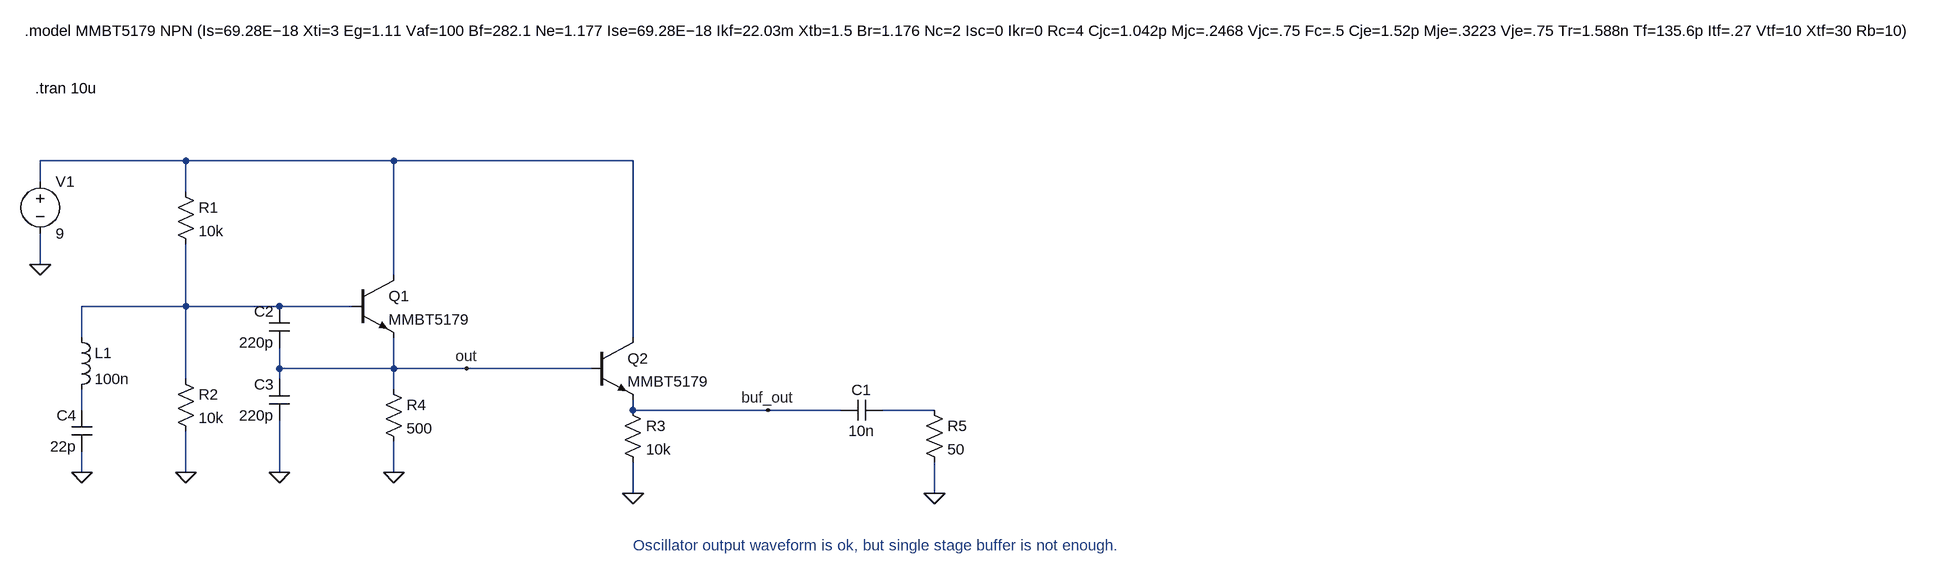
[diagram p0: schematic CC_Clapp_Lund.asc]
CC_Clapp_Lund.asc, the LTspice schematic file:
Version 4
SHEET 1 2820 680
WIRE -192 -240 -416 -240
WIRE 128 -240 -192 -240
WIRE 496 -240 128 -240
WIRE -416 -208 -416 -240
WIRE -192 -192 -192 -240
WIRE -416 -80 -416 -128
WIRE 128 -64 128 -240
WIRE -192 -16 -192 -112
WIRE -192 -16 -352 -16
WIRE -48 -16 -192 -16
WIRE 64 -16 -48 -16
WIRE -352 32 -352 -16
WIRE 496 32 496 -240
WIRE -48 80 -48 48
WIRE 128 80 128 32
WIRE 128 80 -48 80
WIRE 240 80 128 80
WIRE 432 80 240 80
WIRE -192 96 -192 -16
WIRE -48 96 -48 80
WIRE 128 112 128 80
WIRE -352 144 -352 112
WIRE 496 144 496 128
WIRE 704 144 496 144
WIRE 816 144 704 144
WIRE 960 144 880 144
WIRE -352 240 -352 208
WIRE -192 240 -192 176
WIRE -48 240 -48 160
WIRE 128 240 128 192
WIRE 496 272 496 224
WIRE 960 272 960 224
FLAG -416 -80 0
FLAG -352 240 0
FLAG -192 240 0
FLAG -48 240 0
FLAG 128 240 0
FLAG 240 80 out
FLAG 496 272 0
FLAG 704 144 buf_out
FLAG 960 272 0
DATAFLAG -288 -16 ""
DATAFLAG 48 80 ""
DATAFLAG -80 -240 ""
SYMBOL voltage -416 -224 R0
SYMATTR InstName V1
SYMATTR Value 9
SYMBOL res -208 -208 R0
SYMATTR InstName R1
SYMATTR Value 10k
SYMBOL res -208 80 R0
SYMATTR InstName R2
SYMATTR Value 10k
SYMBOL res 112 96 R0
SYMATTR InstName R4
SYMATTR Value 500
SYMBOL cap -32 48 R180
WINDOW 0 24 56 Left 2
WINDOW 3 24 8 Left 2
SYMATTR InstName C2
SYMATTR Value 220p
SYMBOL cap -32 160 R180
WINDOW 0 24 56 Left 2
WINDOW 3 24 8 Left 2
SYMATTR InstName C3
SYMATTR Value 220p
SYMBOL cap -336 208 R180
WINDOW 0 24 56 Left 2
WINDOW 3 24 8 Left 2
SYMATTR InstName C4
SYMATTR Value 22p
SYMBOL ind -368 16 R0
SYMATTR InstName L1
SYMATTR Value 100n
SYMBOL npn 64 -64 R0
SYMATTR InstName Q1
SYMATTR Value MMBT5179
SYMBOL npn 432 32 R0
SYMATTR InstName Q2
SYMATTR Value MMBT5179
SYMBOL res 480 128 R0
SYMATTR InstName R3
SYMATTR Value 10k
SYMBOL cap 880 128 R90
WINDOW 0 0 32 VBottom 2
WINDOW 3 32 32 VTop 2
SYMATTR InstName C1
SYMATTR Value 10n
SYMBOL res 944 128 R0
SYMATTR InstName R5
SYMATTR Value 50
TEXT -440 -440 Left 2 !.model MMBT5179 NPN (Is=69.28E−18 Xti=3 Eg=1.11 Vaf=100 Bf=282.1 Ne=1.177 Ise=69.28E−18 Ikf=22.03m Xtb=1.5 Br=1.176 Nc=2 Isc=0 Ikr=0 Rc=4 Cjc=1.042p Mjc=.2468 Vjc=.75 Fc=.5 Cje=1.52p Mje=.3223 Vje=.75 Tr=1.588n Tf=135.6p Itf=.27 Vtf=10 Xtf=30 Rb=10)
TEXT -424 -352 Left 2 !.tran 10u
TEXT 496 352 Left 2 ;Oscillator output waveform is ok, but single stage buffer is not enough.

The netlist it stands for:
* CC_Clapp_Lund.asc
V1 N001 0 9
R1 N001 N002 10k
R2 N002 0 10k
R4 out 0 500
C2 out N002 220p
C3 0 out 220p
C4 0 N003 22p
L1 N002 N003 100n
Q1 N001 N002 out 0 MMBT5179
Q2 N001 out buf_out 0 MMBT5179
R3 buf_out 0 10k
C1 N004 buf_out 10n
R5 N004 0 50
.model NPN NPN
.model PNP PNP
.lib standard.bjt
.model MMBT5179 NPN (Is=69.28E−18 Xti=3 Eg=1.11 Vaf=100 Bf=282.1 Ne=1.177 Ise=69.28E−18 Ikf=22.03m Xtb=1.5 Br=1.176 Nc=2 Isc=0 Ikr=0 Rc=4 Cjc=1.042p Mjc=.2468 Vjc=.75 Fc=.5 Cje=1.52p Mje=.3223 Vje=.75 Tr=1.588n Tf=135.6p Itf=.27 Vtf=10 Xtf=30 Rb=10)
.tran 10u
* Oscillator output waveform is ok, but single stage buffer is not enough.
.backanno
.end